# Altium schematic sheet DC-DC_5V0_To_24V_TPS61175PWPR.SchDoc
size A4; SheetNumber: 8; SheetTotal: 8
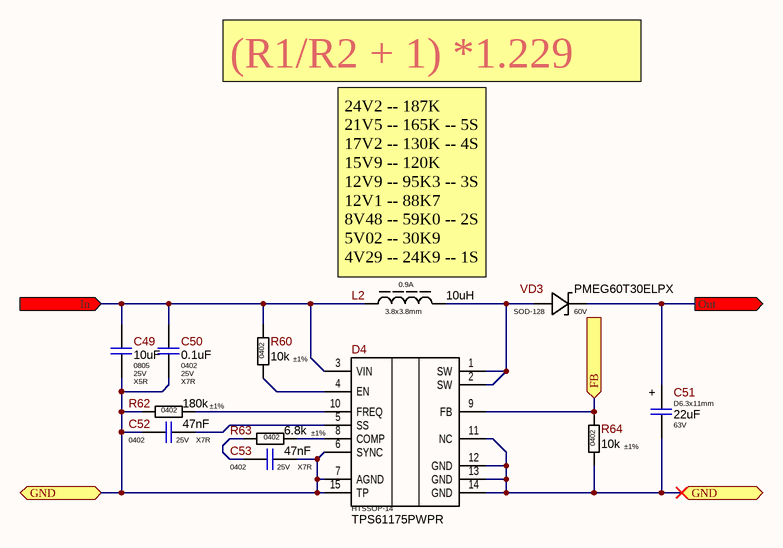
[diagram p0: DC-DC_5V0_To_24V_TPS61175PWPR.SchDoc]

## Parts
C49  Package: 0805  Voltage: 25V  Dielectric Type: X5R  [CAP-0805(2012)X85T10]  (hidden comment: 10uF)
C50  Package: 0402  Voltage: 25V  Dielectric Type: X7R  [C_CERAMIC_0402_MED]  (hidden comment: 0.1uF)
C51  value 22uF  Package: D6.3x11mm  Voltage: 63V  [CAP-AE-PTH-63D05x110H15]  (hidden comment: 22uFx63V)
C52  Package: 0402  Voltage: 25V  Dielectric Type: X7R  [C_CERAMIC_0402_MED]  (hidden comment: 47nF)
C53  Package: 0402  Voltage: 25V  Dielectric Type: X7R  [C_CERAMIC_0402_MED]  (hidden comment: 47nF)
D4  Package: HTSSOP-14  [TSSOP-14_POWER]  (hidden comment: TPS61175PWPR)
L2  Current: 0.9A  Package: 3.8x3.8mm  [CDRH3D18]  (hidden comment: 10uH)
R60  Tolerance: ±1%  Package: 0402  [R_ANY_CHIP_0402_MED]  (hidden comment: 10k)
R62  Tolerance: ±1%  Package: 0402  [R_ANY_CHIP_0402_MED]  (hidden comment: 180k)
R63  Tolerance: ±1%  Package: 0402  [R_ANY_CHIP_0402_MED]  (hidden comment: 6.8k)
R64  Tolerance: ±1%  Package: 0402  [R_ANY_CHIP_0402_MED]  (hidden comment: 10k)
VD3  Voltage: 60V  [SOD-128]  (hidden comment: PMEG60T30ELPX)

## Ports
FB (in, see PowerLoadAdjustableModule[6D]), GND (bidir, see PowerLoadAdjustableModule[5D], PowerModuleCell[1C], PowerModuleCell[3A], PowerModuleCell[3B], PowerModuleCell[3C], PowerModuleCell[3D], PowerModuleCell[4A], PowerModuleCell[4B], PowerModuleCell[4C], PowerModuleCell[4D]), In (in, see PowerLoadAdjustableModule[5D]), Out (out, see PowerLoadAdjustableModule[5D])

## Nets
FB: D4.9(FB) R64.2 ; port FB
GND: C49.2 C50.2 C51.2 C52.1 C53.2 D4.6(SYNC) D4.7(AGND) D4.11(NC) D4.12(GND) D4.13(GND) D4.14(GND) D4.15(TP) R62.1 R64.1 ; port GND
In: C49.1 C50.1 D4.3(VIN) L2.1 R60.2 ; port In
Out: C51.1 VD3.CA ; port Out
NetC52_2: C52.2 D4.5(SS)
NetC53_1: C53.1 R63.2
NetD4_1: D4.1(SW) D4.2(SW) L2.2 VD3.AN
NetD4_4: D4.4(EN) R60.1
NetD4_8: D4.8(COMP) R63.1
NetD4_10: D4.10(FREQ) R62.2

## Notes on the sheet
- (R1/R2 + 1) *1.229
- (near L2) 24V2 -- 187K
  21V5 -- 165K -- 5S
  17V2 -- 130K -- 4S
  15V9 -- 120K
  12V9 -- 95K3 -- 3S
  12V1 -- 88K7
  8V48 -- 59K0 -- 2S
  5V02 -- 30K9
  4V29 -- 24K9 -- 1S
- (in symbol Capacitor-Polar) +

## Library data of the parts
C49 = Capacitor-NonPolar: 10uF 25V X5R ±20% 0805 Ceramic Capacitor RoHS; Part Number: C2012X5R1E106M085AC; Manufacturer: TDK Corporation; Standard Lead Time: 12 Weeks; Component Status: Released; Replacement: NONE; Ajax_1С_Lifecycle: Archived; Value: 10uF; Part Type: Ceramic / X5R / 0805; Component Type: SMD; Temperature Range: -55°C ~ 85°C; Tolerance: ±20%; ComponentLink1URL: https://product.tdk.com/info/en/catalog/datasheets/mlcc_commercial_general_en.pdf; Supplier 1: Digi-Key; Supplier Part Number 1: 445-14388-1-ND; ComponentLink1Description: Datasheet; Price: 0.185
C50 = Capacitor-NonPolar: 100nF 25V X7R ±10% 0402 Ceramic Capacitor RoHS; Part Number: GRM155R71E104KE14D; Manufacturer: Murata Electronics; Standard Lead Time: 15 Weeks; Component Status: Released; Replacement: NONE; Ajax_1С_Lifecycle: Archived; Value: 0.1uF; Part Type: Ceramic / X7R / 0402; Component Type: SMD; Temperature Range: -55°C ~ 125°C; Tolerance: ±10%; ComponentLink1URL: https://search.murata.co.jp/Ceramy/image/img/A01X/G101/ENG/GRM155R71E104KE14-01.pdf; Supplier 1: Digi-Key; Supplier Part Number 1: 490-10698-1-ND; Price: 0.006; ComponentLink1Description: Datasheet
C51 = Capacitor-Polar: 22uF 63V ±20% D6.3x11mm Aluminum Electrolytic Capacitor, Ripple Current 170mA; Part Number: ULD1J220MED; Manufacturer: Nichicon; Standard Lead Time: 80 Weeks; Component Status: Released; Dielectric Type: NONE; Part Type: Aluminum; Component Type: PTH; Temperature Range: -25°C ~ 105°C; Tolerance: ±20%; ComponentLink1URL: https://eu.mouser.com/datasheet/2/293/e_uld-1513276.pdf; Supplier 1: Mouser; Supplier Part Number 1: 647-ULD1J220MED; Replacement: NONE; Price: 0.14; ComponentLink1Description: Datasheet
C52 C53 = Capacitor-NonPolar: 47nF 25V X7R ±10% 0402 Ceramic Capacitor RoHS; Part Number: GRM155R71E473KA88D; Manufacturer: Murata Electronics; Standard Lead Time: 15 Weeks; Replacement: NONE; Component Status: Released; Value: 47nF; Part Type: Ceramic / X7R / 0402; Component Type: SMD; Temperature Range: -55°C ~ 125°C; Tolerance: ±10%; ComponentLink1URL: https://search.murata.co.jp/Ceramy/image/img/A01X/G101/ENG/GRM155R71E473KA88-01.pdf; Supplier 1: Digi-Key; Supplier Part Number 1: 490-3254-2-ND; ComponentLink1Description: Datasheet; Price: 0.00133
D4 = TPS61175PWP: 3A High-Voltage Boost, Flyback, SEPIC Converter With Soft Start and Programmable Switching Frequency, HTSSOP-14; Manufacturer: Texas Instruments; Standard Lead Time: 35 Weeks; Replacement: NONE; Component Status: Released; Part Number: TPS61175PWPR; Part Type: Power / DC-DC; Component Type: SMD; Temperature Range: -40°C ~ 85°C; ComponentLink1URL: https://www.ti.com/lit/ds/symlink/tps61175.pdf; Supplier 1: Digi-Key; Supplier Part Number 1: 296-24013-2-ND; ComponentLink1Description: Datasheet; Price: 2.23
L2 = Inductor-Ferrite-Fixed: 10uH Shielded Power Inductor 900mA 205mOhm Max Nonstandard; Part Number: CDRH3D18NP-100NC; Manufacturer: Sumida; Tolerance: ±30%; Component Status: Released; Standard Lead Time: 28 Weeks; Replacement: NONE; Value: 10uH; Part Type: Power / Ferrite Core; Saturation Current: 0.9A; Component Type: SMD; Temperature Range: -40°C ~ 105°C; ComponentLink1URL: http://products.sumida.com/products/pdf/CDRH3D18.pdf; Supplier 1: Digi-Key; Supplier Part Number 1: 308-1954-6-ND; Price: 0.19; ComponentLink1Description: Datasheet
R60 R64 = Resistor: 10 kOhms ±1% 1/16W 0402 Thick Film Resistor; Part Number: RC0402FR-0710KL; Manufacturer: Yageo; Power Rating: 0.062W; Voltage: 50V; Temperature Stability: ±100ppm/°C; Replacement: NONE; Component Status: Released; Value: 10k; Component Type: SMD; Part Type: Thick Film; Temperature Range: -55°C ~ 155°C; ComponentLink1URL: https://eu.mouser.com/datasheet/2/447/PYu_RC_Group_51_RoHS_L_10-1664068.pdf; ComponentLink1Description: Datasheet; Supplier 1: Digi-Key; Supplier Part Number 1: 311-10.0KLRTR-ND; Price: 0.00065
R62 = Resistor: 180 kOhms ±1% 1/16W 0402 Thick Film Resistor; Part Number: RC0402FR-07180KL; Manufacturer: Yageo; Power Rating: 0.062W; Voltage: 50V; Component Status: Released; Temperature Stability: ±100ppm/°C; Replacement: NONE; Value: 180k; Component Type: SMD; Part Type: Thick Film; Temperature Range: -55°C ~ 155°C; ComponentLink1URL: https://eu.mouser.com/datasheet/2/447/PYu_RC_Group_51_RoHS_L_11-1984063.pdf; Price: 0.00065; ComponentLink1Description: Datasheet
R63 = Resistor: 6.8k kOhms ±1%, 1/16W 0402 Thick Film Resistor; Part Number: RC0402FR-076K8L; Manufacturer: Yageo; Power Rating: 0.062W; Voltage: 50V; Temperature Stability: ±100ppm/°C; Replacement: NONE; Component Status: Released; Value: 6.8k; Component Type: SMD; Part Type: Thick Film; Temperature Range: -55°C ~ 155°C; ComponentLink1URL: https://eu.mouser.com/datasheet/2/447/PYu_RC_Group_51_RoHS_L_11-1984063.pdf; ComponentLink1Description: Datasheet; Supplier 1: Digi-Key; Supplier Part Number 1: 311-6.80KLRTR-ND; Price: 0.00078254
VD3 = Diode-Schottky: Diode Schottky 60V 3A, 550mV @ 3A, 16ns Recovery Time, SOD-128; Manufacturer: Nexperia USA; Marking: E2; Component Status: Released; Standard Lead Time: 20 Weeks; Replacement: NONE; Part Number: PMEG60T30ELPX; Package: SOD-128; Part Type: Schottky; Component Type: SMD; Current: 3A; Vf: 550mV @ 3A; Temperature Range: -55°C ~ 175°C; ComponentLink1URL: https://assets.nexperia.com/documents/data-sheet/PMEG60T30ELP.pdf; Supplier 1: Digi-Key; Supplier Part Number 1: 1727-7809-2-ND; Price: NONE; ComponentLink1Description: Datasheet